# Altium schematic sheet DC-DC-24V-+15V.SchDoc
size A4; SheetNumber: 1; SheetTotal: 1
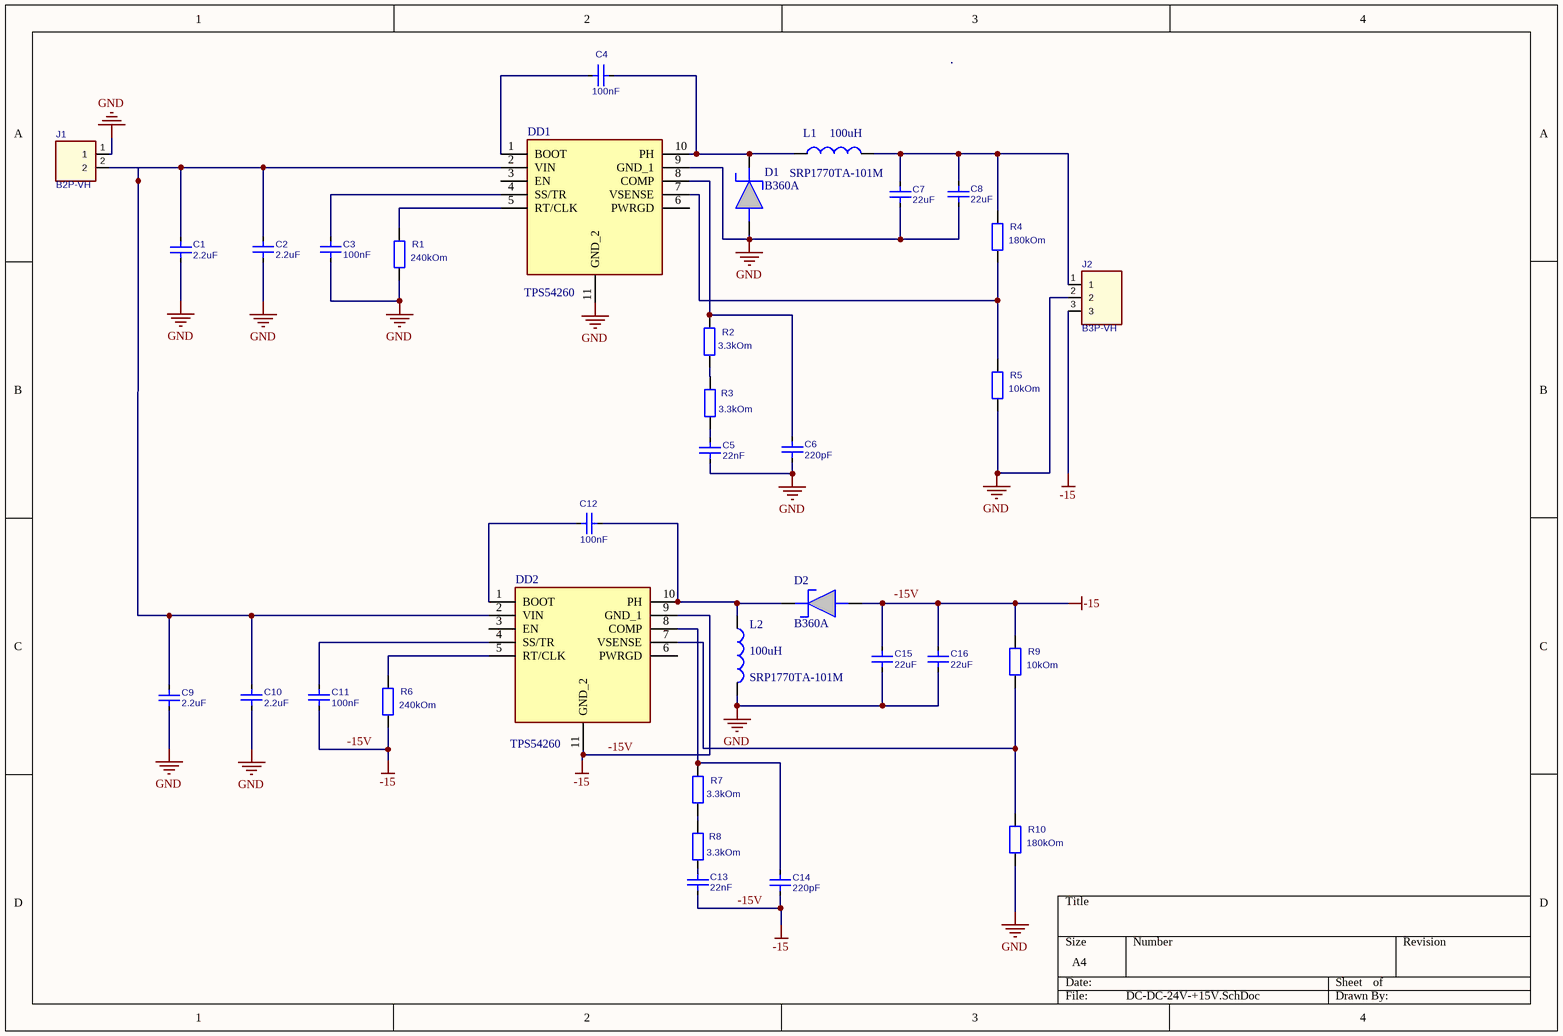
[diagram p0: DC-DC-24V-+15V.SchDoc]

## Parts
C1  2.2uF  [CAPC3216N]
C2  2.2uF  [CAPC3216N]
C3  100nF  [CAPC1608N]
C4  100nF  [CAPC1608N]
C5  22nF  [CAPC1608N]
C6  220pF  [CAPC1608N]
C7  22uF  [CAPC3216N]
C8  22uF  [CAPC3216N]
C9  2.2uF  [CAPC3216N]
C10  2.2uF  [CAPC3216N]
C11  100nF  [CAPC1608N]
C12  100nF  [CAPC1608N]
C13  22nF  [CAPC1608N]
C14  220pF  [CAPC1608N]
C15  22uF  [CAPC3216N]
C16  22uF  [CAPC3216N]
D1  B360A  [B360A]
D2  B360A  [B360A]
DD1  TPS54260  [TPS54260]
DD2  TPS54260  [TPS54260]
J1  B2P-VH  [B2P-VH]
J2  B3P-VH  [B3P-VH]
L1  SRP1770TA-101M  [SRP1770TA-101M]
L2  SRP1770TA-101M  [SRP1770TA-101M]
R1  240kOm  [RESC1608N]
R2  3.3kOm  [RESC1608N]
R3  3.3kOm  [RESC1608N]
R4  180kOm  [RESC1608N]
R5  10kOm  [RESC1608N]
R6  240kOm  [RESC1608N]
R7  3.3kOm  [RESC1608N]
R8  3.3kOm  [RESC1608N]
R9  10kOm  [RESC1608N]
R10  180kOm  [RESC1608N]

## Nets
-15V: C11.1 C13.1 C14.1 C15.2 C16.2 D2.2(A) DD2.9(GND_1) DD2.11(GND_2) J2.3 R6.1 R9.2  [also labelled -15]
GND: C1.1 C2.1 C3.1 C5.1 C6.1 C7.1 C8.1 C9.1 C10.1 C15.1 C16.1 D1.2(A) DD1.9(GND_1) DD1.11(GND_2) J1.1 J2.2 L2.2 R1.1 R5.1 R10.1
NetC1_2: C1.2 C2.2 C9.2 C10.2 DD1.2(VIN) DD2.2(VIN) J1.2
NetC3_2: C3.2 DD1.4(SS/TR)
NetC4_1: C4.1 D1.1(K) DD1.10(PH) L1.1
NetC4_2: C4.2 DD1.1(BOOT)
NetC5_2: C5.2 R3.1
NetC6_2: C6.2 DD1.8(COMP) R2.2
NetC7_2: C7.2 C8.2 J2.1 L1.2 R4.2
NetC11_2: C11.2 DD2.4(SS/TR)
NetC12_1: C12.1 D2.1(K) DD2.10(PH) L2.1
NetC12_2: C12.2 DD2.1(BOOT)
NetC13_2: C13.2 R8.1
NetC14_2: C14.2 DD2.8(COMP) R7.2
NetDD1_5: DD1.5(RT/CLK) R1.2
NetDD1_7: DD1.7(VSENSE) R4.1 R5.2
NetDD2_5: DD2.5(RT/CLK) R6.2
NetDD2_7: DD2.7(VSENSE) R9.1 R10.2
NetR2_1: R2.1 R3.2
NetR7_1: R7.1 R8.2

Not connected (* = marked no-connect by the designer): DD1 3(EN) 6(PWRGD); DD2 3(EN) 6(PWRGD)

## Notes on the sheet
- (near L1) 100uH
- (near L2) 100uH
- Labels drawn without touching a wire or pin: -15V

## Library data of the parts
C1 C2 C7-C10 C15 C16 = Cap 3216 (1206): Capacitor; Value: 100pF
C3-C6 C11-C14 = Cap 1608 (0603): Capacitor; Value: 100pF
J1 = B2P-VH: B2P-VH (JST 3.96mm)
J2 = B3P-VH: B3P-VH (JST 3.96mm)
R1-R10 = Res 1608 (0603): Resistor 1608 (0603); Value: 1K